# EAGLE design ESP_FSR_v4 (EAGLE 8.1.1)
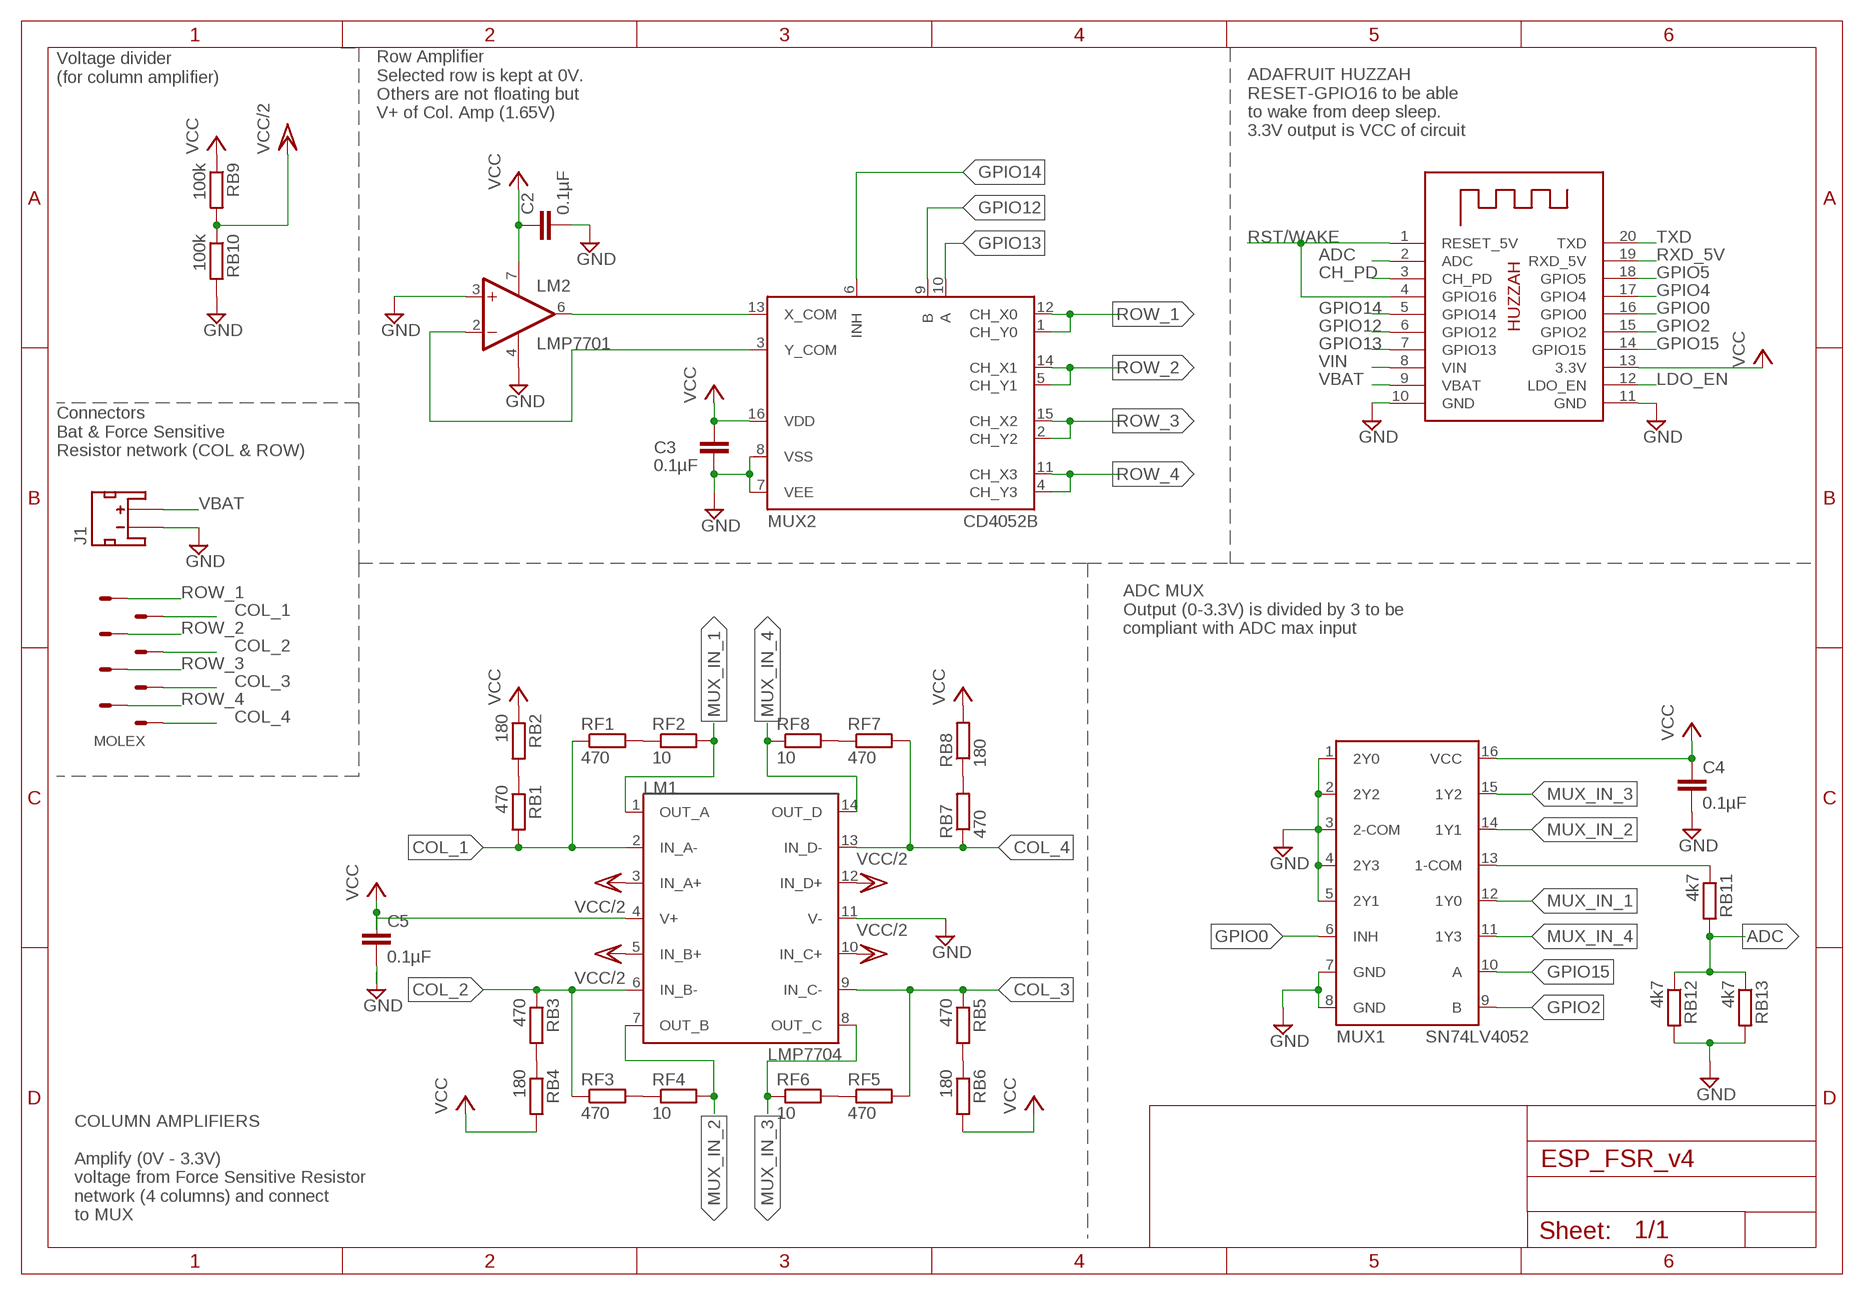
[diagram p0: schematic, sheet 1]

## Parts
C2  0.1µF  C-EUC0805  [C0805]
C3  0.1µF  C-EUC0805  [C0805]
C4  0.1µF  C-EUC0805  [C0805]
C5  0.1µF  C-EUC0805  [C0805]
J1  JST_2MM_MALE  [JST-2-SMD]
LM1  LMP7704  [D_R-PDSO-G14]
LM2  LMP7701  [D_R-PDSO-G08]
MOLEX  90130-3308  [90130-3308]
MUX1  SN74LV4052  [D_R-PDSO-G16]
MUX2  CD4052B  [D_R-PDSO-G16]
RB1  470  R-EU_R0805  [R0805]
RB2  180  R-EU_R0805  [R0805]
RB3  470  R-EU_R0805  [R0805]
RB4  180  R-EU_R0805  [R0805]
RB5  470  R-EU_R0805  [R0805]
RB6  180  R-EU_R0805  [R0805]
RB7  470  R-EU_R0805  [R0805]
RB8  180  R-EU_R0805  [R0805]
RB9  100k  R-EU_R0805  [R0805]
RB10  100k  R-EU_R0805  [R0805]
RB11  4k7  R-EU_R0805  [R0805]
RB12  4k7  R-EU_R0805  [R0805]
RB13  4k7  R-EU_R0805  [R0805]
RF1  470  R-EU_R0805  [R0805]
RF2  10  R-EU_R0805  [R0805]
RF3  470  R-EU_R0805  [R0805]
RF4  10  R-EU_R0805  [R0805]
RF5  470  R-EU_R0805  [R0805]
RF6  10  R-EU_R0805  [R0805]
RF7  470  R-EU_R0805  [R0805]
RF8  10  R-EU_R0805  [R0805]
U$1  HUZZAH  [HUZZAH]

## Nets
ADC: RB11.2 RB12.1 RB13.1 U$1.2(ADC)
CH_PD: U$1.3(CH_PD)
COL_1: LM1.2(IN_A-) MOLEX.P$2 RB1.2 RF1.1
COL_2: LM1.6(IN_B-) MOLEX.P$4 RB3.1 RF3.1
COL_3: LM1.9(IN_C-) MOLEX.P$6 RB5.1 RF5.2
COL_4: LM1.13(IN_D-) MOLEX.P$8 RB7.1 RF7.2
GND: C2.2 C3.2 C4.2 C5.2 J1.1(-) LM1.11(V-) LM2.3(+IN) LM2.4(V-) MUX1.1(2Y0) MUX1.2(2Y2) MUX1.3(2-COM) MUX1.4(2Y3) MUX1.5(2Y1) MUX1.7(GND) MUX1.8(GND) MUX2.7(VEE) MUX2.8(VSS) RB10.2 RB12.2 RB13.2 U$1.10(GND) U$1.11(GND)
GPIO0: MUX1.6(INH) U$1.16(GPIO0)
GPIO2: MUX1.9(B) U$1.15(GPIO2)
GPIO4: U$1.17(GPIO4)
GPIO5: U$1.18(GPIO5)
GPIO12: MUX2.9(B) U$1.6(GPIO12)
GPIO13: MUX2.10(A) U$1.7(GPIO13)
GPIO14: MUX2.6(INH) U$1.5(GPIO14)
GPIO15: MUX1.10(A) U$1.14(GPIO15)
LDO_EN: U$1.12(LDO_EN)
MUX_IN_1: LM1.1(OUT_A) MUX1.12(1Y0) RF2.2
MUX_IN_2: LM1.7(OUT_B) MUX1.14(1Y1) RF4.2
MUX_IN_3: LM1.8(OUT_C) MUX1.15(1Y2) RF6.1
MUX_IN_4: LM1.14(OUT_D) MUX1.11(1Y3) RF8.1
N$1: RB3.2 RB4.1
N$2: RF1.2 RF2.1
N$3: MUX1.13(1-COM) RB11.1
N$4: RF5.1 RF6.2
N$20: LM2.6(OUT) MUX2.13(X_COM)
N$22: LM2.2(-IN) MUX2.3(Y_COM)
N$24: RF7.1 RF8.2
N$25: RB5.2 RB6.1
N$27: RB1.1 RB2.2
N$31: RF3.2 RF4.1
N$32: RB7.2 RB8.1
ROW_1: MOLEX.P$1 MUX2.1(CH_Y0) MUX2.12(CH_X0)
ROW_2: MOLEX.P$3 MUX2.5(CH_Y1) MUX2.14(CH_X1)
ROW_3: MOLEX.P$5 MUX2.2(CH_Y2) MUX2.15(CH_X2)
ROW_4: MOLEX.P$7 MUX2.4(CH_Y3) MUX2.11(CH_X3)
RST/WAKE: U$1.1(RESET_5V) U$1.4(GPIO16)
RXD_5V: U$1.19(RXD_5V)
TXD: U$1.20(TXD)
VBAT: J1.2(+) U$1.9(VBAT)
VCC: C2.1 C3.1 C4.1 C5.1 LM1.4(V+) LM2.7(V+) MUX1.16(VCC) MUX2.16(VDD) RB2.1 RB4.2 RB6.2 RB8.2 RB9.1 U$1.13(3.3V)
VCC/2: LM1.3(IN_A+) LM1.5(IN_B+) LM1.10(IN_C+) LM1.12(IN_D+) RB9.2 RB10.1
VIN: U$1.8(VIN)
Unconnected: J1.NC1(PAD1) J1.NC2(PAD2)

## Notes on the sheet
- Voltage divider
  (for column amplifier)
- Row Amplifier
  Selected row is kept at 0V.
  Others are not floating but
  V+ of Col. Amp (1.65V)
- ADAFRUIT HUZZAH
  RESET-GPIO16 to be able
  to wake from deep sleep.
  3.3V output is VCC of circuit
- Connectors
  Bat & Force Sensitive
  Resistor network (COL & ROW)
- ADC MUX
  Output (0-3.3V) is divided by 3 to be
  compliant with ADC max input
- COLUMN AMPLIFIERS
  
  Amplify (0V - 3.3V)
  voltage from Force Sensitive Resistor
  network (4 columns) and connect
  to MUX

## Library data of the parts
C2-C5 = rcl:C-EU: CAPACITOR, European symbol
J1 = SparkFun-Connectors:JST_2MM_MALE: JST 2MM MALE RA CONNECTOR Two pin, compact surface mount connector. Commonly used as a battery input connection point. We really like the solid locking feeling and high current rating on these small connectors. We use these all the time as battery connectors. Mates to single-cell LiPo batteries. Here is the connector we sell at SparkFun: JST Right Angle Connector - White <https://www.sparkfun.com/products/8612> (PRT-08612) Datasheet <http://www.sparkfun.com/datasheets/Prototyping/Connectors/JST-Horizontal.pdf> It was used on these SparkFun products: SparkFun MOSFET Power Controller <https://www.sparkfun.com/products/11214> (PRT-11214) SparkFun Battery Babysitter - LiPo Battery Manager <https://www.sparkfun.com/products/13777> (PRT-13777) And many, many others that required a lipo battery connection.; PROD_ID: CONN-11443; SF_ID: PRT-08612
LM1 = texas:LMP7704: LMP7704 From http://www.ti.com/lit/ds/symlink/lmp7701.pdf
LM2 = texas:LMP7701
MOLEX = con-molex:90130-3308
MUX1 = texas:SN74LV4052
MUX2 = texas:CD4052B: CD4052B CMOS Differential 4-Channel Analog Multiplexer/Demultiplexer with Logic-Level Conversion From: http://www.ti.com/lit/ds/symlink/cd4052b.pdf
RB1-RB13 RF1-RF8 = rcl:R-EU_: RESISTOR, European symbol
U$1 = adafruit:HUZZAH

## Board
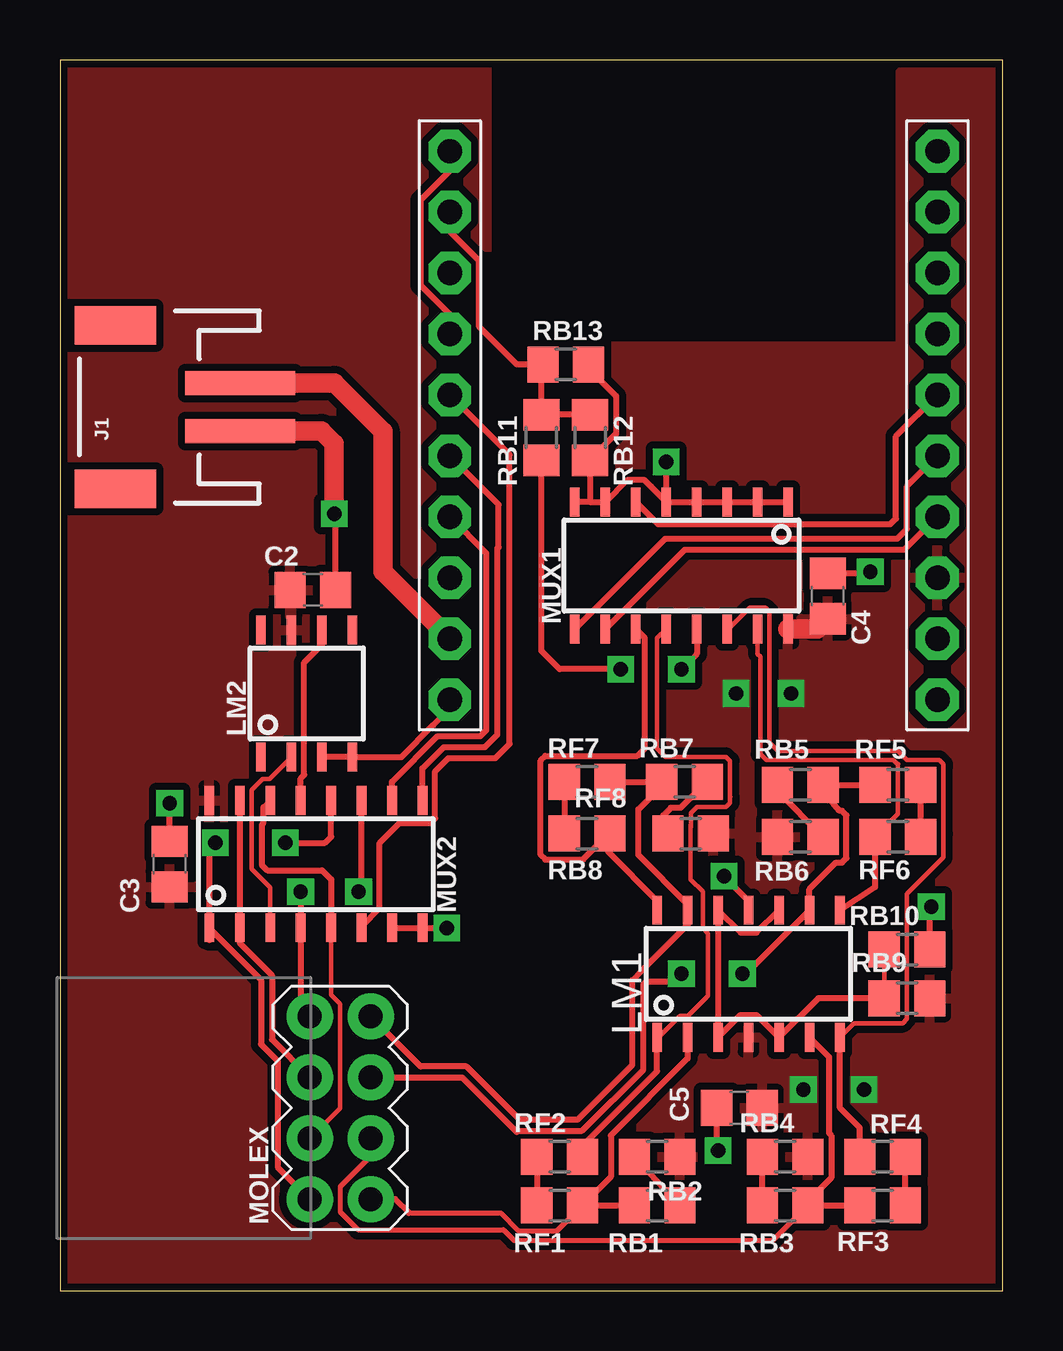
[diagram p1: board, top side]
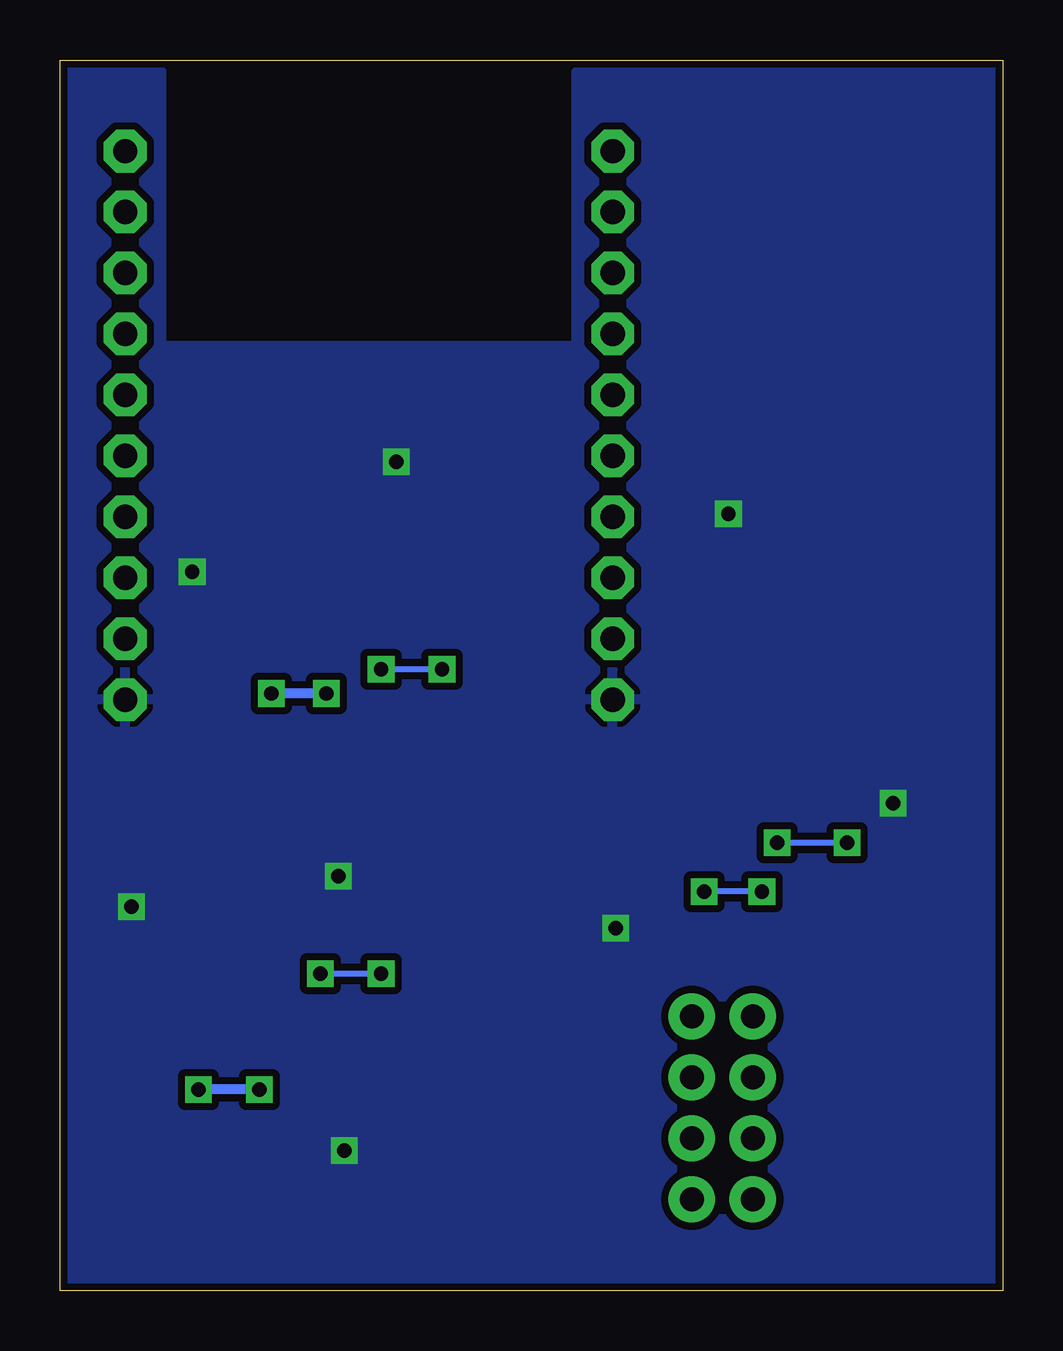
[diagram p2: board, bottom side, seen from below]

Size 39.29 x 51.3 mm. Coordinates in mm from the lower left corner, seen from the top.
Outline: 0,0 39.29,0 39.29,51.3 0,51.3 0,0
Copper layers (1*16): Top 0.035mm / dielectric 1.5mm / Bottom 0.035mm
Design rules "SparkFun *": minimum track width 7mil, minimum drill 20mil, track to track 8mil, track to pad 8mil, pad to pad 8mil, via to via 8mil, smd to smd 8mil, copper to edge 10mil, drill to drill 8mil, minimum pad ring 12mil, minimum via ring 10mil, stop-mask expansion 4mil, vias tented up to drill 25mil, thermal gap 10mil

### Footprints (pad centres in the part's own frame; a part is rotated, then mirrored left to right if it is on the bottom)
C0805 = smd 1.3 x 1.5: 1 -0.95,0; 2 0.95,0
JST-2-SMD = smd 1 x 4.6: 1 -1,-3.7; 2 1,-3.7 | smd 1.6 x 3.4: NC1 -3.4,1.5; NC2 3.4,1.5
D_R-PDSO-G14 = smd 0.4 x 1.2: 1 -3.81,-2.65; 2 -2.54,-2.65; 3 -1.27,-2.65; 4 0,-2.65; 5 1.27,-2.65; 6 2.54,-2.65; 7 3.81,-2.65; 8 3.81,2.65; 9 2.54,2.65; 10 1.27,2.65; 11 0,2.65; 12 -1.27,2.65; 13 -2.54,2.65; 14 -3.81,2.65
D_R-PDSO-G08 = smd 0.4 x 1.2: 1 -1.905,-2.65; 2 -0.635,-2.65; 3 0.635,-2.65; 4 1.905,-2.65; 5 1.905,2.65; 6 0.635,2.65; 7 -0.635,2.65; 8 -1.905,2.65
90130-3308 = drill 1 pad 1.93: P$1 -3.81,1.27; P$2 -3.81,-1.27; P$3 -1.27,1.27; P$4 -1.27,-1.27; P$5 1.27,1.27; P$6 1.27,-1.27; P$7 3.81,1.27; P$8 3.81,-1.27
D_R-PDSO-G16 = smd 0.4 x 1.2: 1 -4.445,-2.65; 2 -3.175,-2.65; 3 -1.905,-2.65; 4 -0.635,-2.65; 5 0.635,-2.65; 6 1.905,-2.65; 7 3.175,-2.65; 8 4.445,-2.65; 9 4.445,2.65; 10 3.175,2.65; 11 1.905,2.65; 12 0.635,2.65; 13 -0.635,2.65; 14 -1.905,2.65; 15 -3.175,2.65; 16 -4.445,2.65
R0805 = smd 1.3 x 1.5: 1 -0.95,0; 2 0.95,0
HUZZAH = drill 1.016 pad 1.778 octagon: 1 -10.16,11.43; 2 -10.16,8.89; 3 -10.16,6.35; 4 -10.16,3.81; 5 -10.16,1.27; 6 -10.16,-1.27; 7 -10.16,-3.81; 8 -10.16,-6.35; 9 -10.16,-8.89; 10 -10.16,-11.43; 11 10.16,-11.43; 12 10.16,-8.89; 13 10.16,-6.35; 14 10.16,-3.81; 15 10.16,-1.27; 16 10.16,1.27; 17 10.16,3.81; 18 10.16,6.35; 19 10.16,8.89; 20 10.16,11.43

### Placement (x,y rotation side)
C2  10.54,29.21 0 top
C3  4.57,17.78 90 top
C4  32,28.96 90 top
C5  28.32,7.62 180 top
J1  3.81,36.83 90 top
LM1  28.7,13.21 0 top
LM2  10.29,24.89 0 top
MOLEX  11.68,7.62 90 top
MUX1  25.91,30.23 180 top
MUX2  10.67,17.78 0 top
RB1  24.89,3.56 180 top
RB2  24.89,5.59 180 top
RB3  30.23,3.56 180 top
RB4  30.23,5.59 0 top
RB5  30.86,21.08 180 top
RB6  30.86,18.92 180 top
RB7  26.04,21.21 0 top
RB8  26.29,19.05 0 top
RB9  35.31,12.19 180 top
RB10  35.31,14.22 0 top
RB11  20.07,35.56 90 top
RB12  22.1,35.56 270 top
RB13  21.08,38.61 0 top
RF1  20.83,3.56 180 top
RF2  20.83,5.59 0 top
RF3  34.29,3.56 0 top
RF4  34.29,5.59 180 top
RF5  34.92,21.08 180 top
RF6  34.92,18.92 0 top
RF7  21.97,21.21 0 top
RF8  21.97,19.05 180 top
U$1  26.42,36.07 0 top

### Tracks (layer width: path | path; a pad name or v marks a point on that pad's centre or on a via)
ADC
  Top 0.254: RB12.1 RB11.2 20.07,38.54 RB13.1 19.05,38.61 17.48,40.18 17.48,42.92 16.26,44.14 U$1.2
COL_1
  Top 0.203: 14.54,3.24 18.36,3.24 19.1,2.5 20.72,2.5 RF1.1
  Top 0.254: MOLEX.P$2 13.97,3.81 14.54,3.24 | RB1.2 RF1.1 22.96,4.74 22.96,6.47 26.16,9.68 LM1.2
COL_2
  Top 0.203: MOLEX.P$4 12.95,5.61 11.68,4.34 11.68,3.28 12.43,2.54 18.49,2.54 18.93,2.1 29.71,2.1 RB3.1
  Top 0.254: RF3.1 RB3.1 31.18,3.72 32.16,4.7 32.16,6.47 32.05,6.58 32.05,9.74 LM1.6
COL_3  (via drill 0.6)
  Top 0.254: RB5.1 RF5.2 | 31.56,20.79 RB5.1 | v25.91,13.21 25.59,12.88 24.45,12.88 24.32,12.75 24.32,9.21 21.77,6.67 19.09,6.67 19.04,6.62 17.65,8 | v28.45,13.21 28.59,13.21 LM1.9 31.24,16.74 32.34,17.84 32.6,17.84 32.79,18.04 32.79,19.81 32.6,20 32.5,20 32,20.57 32,20.89 RB5.1 | 17.65,8 17.53,8.13 | MOLEX.P$6 16.76,8.89 17.65,8
  Bottom 0.254: v25.91,13.21 v28.45,13.21
COL_4
  Top 0.254: 24.26,13.34 | 24.26,13.34 26.16,15.24 LM1.13 26.16,16.11 24.11,18.16 24.11,20.06 25.09,21.04 RB7.1 RF7.2 | 24.26,13.34 23.86,12.94 23.86,9.4 21.58,7.12 19.18,7.12 16.95,9.35 15.04,9.35 MOLEX.P$8
GND  (via drill 0.6)
  Top 0.254: LM2.3 LM2.4 14.23,22.24 15.56,23.57 15.57,23.57 16.13,24.13 16.13,24.51 U$1.10 | C2.2 11.49,32.32 v11.43,32.38 | MUX2.7 MUX2.8 16.11,15.13 v16.13,15.11 | C3.2 v4.57,20.32 | LM1.11 28.7,16.26 v27.69,17.27 | 22.1,32.88 MUX1.8 | 22.1,32.88 MUX1.7 23.67,33.81 24.34,33.81 24.62,33.53 24.64,33.53 24.64,33.51 MUX1.5 | MUX1.5 MUX1.4 MUX1.3 MUX1.2 MUX1.1 | 32,29.95 C4.2 33.72,29.91 v33.78,29.97 | 22.1,32.88 RB12.2 22.1,34.64 23.18,35.72 23.18,37.3 22.03,38.44 RB13.2 | RB10.2 36.26,15.94 v36.32,16 | C5.2 27.37,5.9 v27.43,5.84 | MUX1.5 v25.27,34.54
  Top 0.813: 7.53,35.81 J1.1 10.91,35.83 11.43,35.31 v11.43,32.38
  pour Bottom (isolate 0.305): 0,0 0,50.8 17.78,50.8 17.78,39.37 35.05,39.37 35.05,50.8 39.12,50.8 39.12,0
GPIO0
  Top 0.254: MUX1.6 24.94,31.95 34.61,31.95 34.85,32.18 34.85,35.61 U$1.16
GPIO2
  Top 0.254: MUX1.9 25.23,31.34 34.9,31.34 35.31,31.75 35.31,33.53 U$1.15
GPIO12
  Top 0.254: MUX2.9 15.11,21.77 16,22.66 17.71,22.66 18.24,23.18 18.24,30.94 18.29,30.99 18.29,32.77 U$1.6
GPIO13
  Top 0.254: MUX2.10 13.84,21.21 15.75,23.11 17.53,23.11 17.78,23.37 17.78,30.73 U$1.7
GPIO14
  Top 0.254: 12.57,15.29 MUX2.6 12.57,15.19 13.33,15.95 13.33,18.66 14.17,19.5 15.45,19.5 15.64,19.69 15.64,21.65 16.19,22.2 18.15,22.2 18.75,22.8 18.75,34.85 U$1.5
GPIO15
  Top 0.254: MUX1.10 26.05,30.89 35.2,30.89 U$1.14
MUX_IN_1
  Top 0.178: LM1.1 24.95,10.56 25.84,11.45 26.18,11.45 27.01,12.28 27.01,14.9 26.8,15.11 26.8,16.64 26.29,17.14 26.29,19.3 | 26.29,19.3 26.29,19.41 | 26.29,19.3 26.3,19.31 26.3,19.92 26.54,20.17 27.76,20.17 27.93,20.34 27.93,20.56 27.94,20.57 27.93,20.59 27.93,22.08 27.76,22.25 25.25,22.25 24.89,22.61 24.89,27.2 MUX1.12 25.39,27.46
  Top 0.254: RF2.2 21.78,6.03 24.89,9.14 LM1.1 | MUX1.12
MUX_IN_2
  Top 0.178: LM1.7 33.1,11.15 35.13,11.15 35.3,11.32 35.3,16.53 36.82,18.05 36.82,19.04 36.83,19.05 36.83,21.84 | 36.83,21.84 36.83,21.94 | 36.83,21.84 36.82,21.86 36.82,21.95 36.65,22.12 35.31,22.12 34.93,22.5 29.93,22.5 29.57,22.86 29.57,28.3 29.4,28.47 28.76,28.47 27.87,27.58 MUX1.14
  Top 0.254: RF4.2 33.34,6.79 32.51,7.62 LM1.7
MUX_IN_3
  Top 0.178: 29.08,27.09 MUX1.15 29.08,26.54 29.19,26.43 29.19,22.37 29.44,22.12 34.75,22.12 34.91,21.96 34.94,21.96 34.93,21.95 34.93,19.88 RF6.1
  Top 0.254: MUX1.15 | RF6.1 33.98,16.81 LM1.8
MUX_IN_4
  Top 0.254: 24.82,15.79 LM1.14 | LM1.14 | LM1.14 24.89,16.26 22.86,18.29 22.86,18.99 RF8.1 22.89,19.05 21.81,17.97 20.23,17.97 20.04,18.16 20.04,22.1 20.23,22.29 24.07,22.29 24.38,22.61 24.38,27.2 MUX1.11
N$1
  Top 0.254: RB3.2 RB4.1
N$2
  Top 0.254: RF2.1 RF1.2
N$3  (via drill 0.6)
  Top 0.254: MUX1.13 26.54,26.54 v25.91,25.91 | v23.37,25.91 20.83,25.91 20.07,26.67 RB11.1
  Bottom 0.254: v25.91,25.91 v23.37,25.91
N$4
  Top 0.254: RF6.2 RF5.1
N$20
  Top 0.254: MUX2.13 10.03,21.36 10.18,21.5 10.18,26.18 10.92,26.92 LM2.6
N$22
  Top 0.178: MUX2.3 8.76,16.81 7.99,17.58 7.99,20.87 8.44,21.32 8.73,21.32 LM2.2
N$24
  Top 0.254: RF7.1 RF8.2
N$25
  Top 0.254: 31.56,19.18 RB6.1 29.91,20.82 RB5.2
N$27
  Top 0.254: RB2.2 RB1.1
N$31
  Top 0.254: RF3.2 RF4.1
N$32
  Top 0.254: RB7.2 26.95,21.21 25.87,20.13 25.46,20.13 25.15,19.81 25.15,19.24 RB8.1
ROW_1  (via drill 0.6)
  Top 0.254: MUX2.1 6.22,18.41 v6.48,18.67 | v9.4,18.67 11.05,18.67 11.3,18.92 MUX2.12 | MUX2.1 6.22,14.61 | MOLEX.P$1 9.07,5.15 9.07,9.58 8.38,10.28 8.38,12.95 6.22,15.11 MUX2.1
  Bottom 0.254: v6.48,18.67 v9.4,18.67
ROW_2
  Top 0.178: MOLEX.P$3 11.67,7.61 11.67,11.95 11.3,12.32 MUX2.5
  Top 0.254: MUX2.5 11.3,17.14 10.92,17.53 8.64,17.53 8.41,17.75 8.41,19.43 8.48,19.5 8.48,20.15 MUX2.14
ROW_3
  Top 0.254: MUX2.15 MUX2.2 | MUX2.2 7.49,15.11 | MUX2.2 7.49,14.49 8.84,13.14 8.84,10.46 MOLEX.P$5
ROW_4  (via drill 0.6)
  Top 0.254: v10.03,16.64 MUX2.4 10.03,11.81 MOLEX.P$7 | v12.45,16.64 12.57,16.64 MUX2.11
  Bottom 0.254: v10.03,16.64 v12.45,16.64
RST/WAKE
  Top 0.254: U$1.1 16.26,46.68 15.04,45.46 15.04,41.91 16.26,40.69 U$1.4
VBAT
  Top 0.813: J1.2 11.45,37.83 13.46,35.81 13.46,29.97 U$1.9
VCC  (via drill 0.6)
  Top 0.813: MUX1.16 31.57,27.58 C4.1
  Bottom 0.406: v28.19,24.89 v30.48,24.89 | v30.99,8.38 v33.53,8.38
  pour Top (isolate 0.305): 0,0 0,50.8 17.78,51.05 17.78,39.37 35.05,39.37 35.05,50.8 39.12,50.8 39.12,0
VCC/2
  Top 0.178: RB10.1 RB9.2
  Top 0.254: LM1.10 29.04,14.93 28.36,14.93 LM1.12 LM1.3 28.36,11.49 29.04,11.49 29.09,11.44 LM1.5 31.61,12.19 RB9.2